# EAGLE design HX4002 CE021 + MAX40200 (EAGLE 9.6.2)
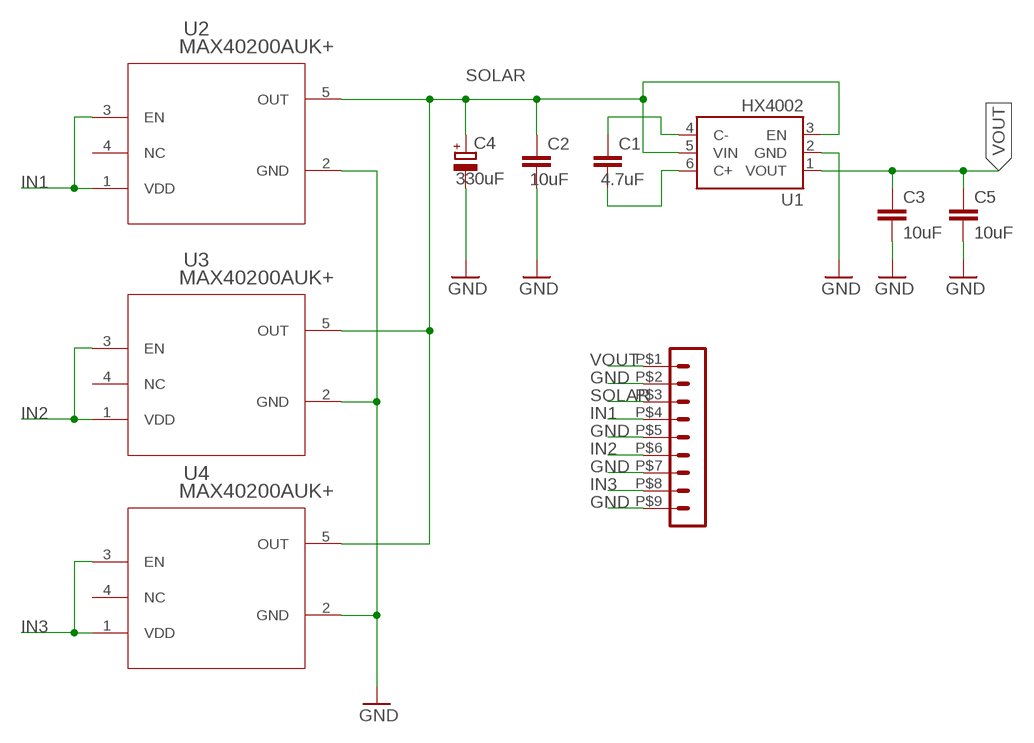
[diagram p0: schematic, sheet 1]

## Parts
C1  4.7uF  CAP-0805  [0805]
C2  10uF  CAP-0805  [0805]
C3  10uF  CAP-0805  [0805]
C4  330uF  CPOL-EUSMCC  [SMC_C]
C5  10uF  CAP-0805  [0805]
U1  HX4002  CE021SOT-23  [SOT23-6]
U2  MAX40200AUK+  [21-0057F_MXM]
U3  MAX40200AUK+  [21-0057F_MXM]
U4  MAX40200AUK+  [21-0057F_MXM]
X2  M_1R09_50MIL-V  [M_1R09_50MIL-V]

## Nets
GND: C2.2 C3.2 C4.- C5.2 U1.2(GND) U2.2(GND) U3.2(GND) U4.2(GND) X2.P$2 X2.P$5 X2.P$7 X2.P$9
IN1: U2.1(VDD) U2.3(EN) X2.P$4
IN2: U3.1(VDD) U3.3(EN) X2.P$6
IN3: U4.1(VDD) U4.3(EN) X2.P$8
N$1: C1.1 U1.4(C-)
N$3: C1.2 U1.6(C+)
SOLAR: C2.1 C4.+ U1.3(EN) U1.5(VIN) U2.5(OUT) U3.5(OUT) U4.5(OUT) X2.P$3
VOUT: C3.1 C5.1 U1.1(VOUT) X2.P$1
Unconnected: U2.4(NC) U3.4(NC) U4.4(NC)

## Library data of the parts
C1-C3 C5 = SparkFun-Capacitors:CAP
C4 = rcl:CPOL-EU: POLARIZED CAPACITOR, European symbol; SPICEPREFIX: C
U1 = CE021-KW:CE021: CE021 Hexin 3.3v Boost/Buck, SOT23-6 Datasheet <http://www.jiecx.com/files856985665897965/productpdf/2013-7-5/545010255.pdf>
U2-U4 = MAX40200AUK:MAX40200AUK+; BUILT_BY: EMA_UL_Team; COPYRIGHT: Copyright (C) 2018 Accelerated Designs. All rights reserved; MANUFACTURER_PART_NUMBER: MAX40200AUK+; SOURCELIBRARY: Maxim_2018-11-30; VENDOR: Maxim Integrated Products
X2 = con pinheader male:M_1R09: Pin header, male, 1 row

## Board
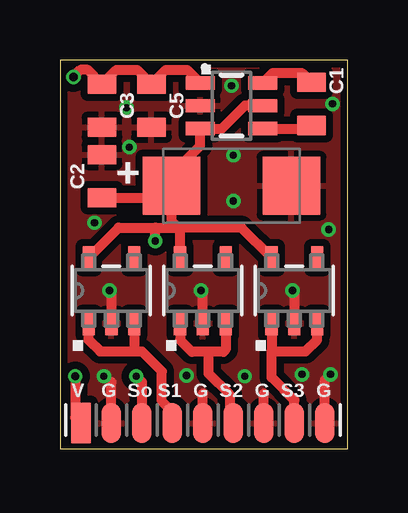
[diagram p1: board, top side]
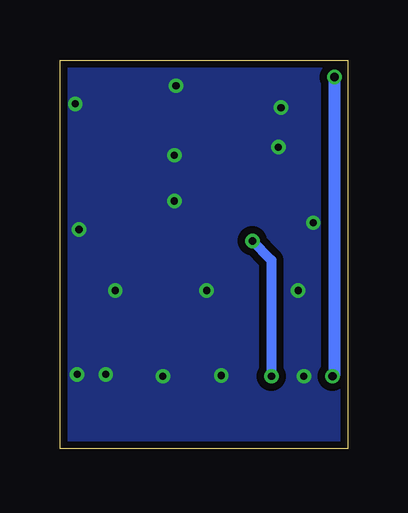
[diagram p2: board, bottom side, seen from below]

Size 11.99 x 16.19 mm. Coordinates in mm from the lower left corner, seen from the top.
Outline: 0,0 11.99,0 11.99,16.19 0,16.19 0,0
Copper layers (1*16): Top 0.035559375mm / dielectric 1.6mm / Bottom 0.035559375mm
Design rules "Arxterra-HLCpcb-2-layer-KW": minimum track width 6mil, minimum drill 0.3mm, track to track 6mil, track to pad 6mil, pad to pad 6mil, via to via 10mil, smd to smd 6mil, copper to edge 8mil, drill to drill 6mil, minimum pad ring 5mil, minimum via ring 3mil, stop-mask expansion 2.5mil, vias tented up to drill 25mil, thermal gap 10mil

### Footprints (pad centres in the part's own frame; a part is rotated, then mirrored left to right if it is on the bottom)
0805 = smd 0.8 x 1.2: 1 -0.9,0; 2 0.9,0
SMC_C = smd 2.4 x 2.4: + -2.5,0; - 2.5,0
SOT23-6 = smd 0.55 x 1.2: 1 0.95,1.3; 2 0,1.3; 3 -0.95,1.3; 4 -0.95,-1.3; 5 0,-1.3; 6 0.95,-1.3
21-0057F_MXM = smd 0.978 x 0.508: 1 -1.365,0.95; 2 -1.365,0; 3 -1.365,-0.95; 4 1.365,-0.95; 5 1.365,0.95
M_1R09_50MIL-V = smd 0.813 x 1.676: P$1 -5.08,-0.127; P$2 -3.81,-0.127; P$3 -2.54,-0.127; P$4 -1.27,-0.127; P$5 0,-0.127; P$6 1.27,-0.127; P$7 2.54,-0.127; P$8 3.81,-0.127; P$9 5.08,-0.127

### Placement (x,y rotation side)
C1  10.48,14.37 90 top
C2  1.75,11.35 90 top
C3  1.75,14.29 270 top
C4  7.14,10.95 0 top
C5  3.81,14.29 270 top
U1  7.14,14.29 90 top
U2  2.14,6.59 90 top
U3  5.95,6.59 90 top
U4  9.76,6.59 90 top
X2  5.95,1.19 0 top

### Tracks (layer width: path | path; a pad name or v marks a point on that pad's centre or on a via)
GND  (via drill 0.3 pad 0.6)
  Top 0.406: U3.2 5.95,6.51 | U2.2 2.14,6.51 v2.06,6.59 | U4.2 9.76,6.51 v9.68,6.59 | X2.P$2 2.14,2.78 | X2.P$5 5.95,2.3 | X2.P$7 8.49,2.3 | X2.P$9 11.03,2.86 v11.27,3.1
  other vias: 5.87,6.59 7.15,15.12 1.83,3.02 7.7,3.02 10.08,3.1 5.27,3.04 1.43,9.41 11.19,9.13 2.89,12.56 7.22,10.32 11.35,14.37 7.22,12.22 2.77,14.21
  pour Top (isolate 0.305): 0,0 0,16.19 11.99,16.19 11.99,0
  pour Bottom (isolate 0.305): 0,0 0,16.19 11.99,16.19 11.99,0
IN1
  Top 0.406: U2.3 3.09,4.05 3.1,4.05 | X2.P$4 4.68,1.54 4.25,1.98 4.25,3.21 3.41,4.05 3.1,4.05 | U2.1 1.19,4.52 1.67,4.05 3.1,4.05
IN2
  Top 0.406: U3.1 5,4.53 5,4.52 5.5,4.03 6.19,4.03 | U3.3 6.91,4.13 6.81,4.03 6.19,4.03 | X2.P$6 7.06,1.22 7.06,2.26 6.19,3.13 6.19,4.03
IN3
  Top 0.406: U4.1 8.81,4.05 | U4.3 10.72,4.52 10.24,4.05 8.81,4.05 | X2.P$8 9.76,2.02 8.81,2.97 8.81,4.05
N$1
  Top 0.406: U1.4 10.35,13.34 C1.1
N$3
  Top 0.406: U1.6 8.84,15.63 10.11,15.63 C1.2
SOLAR  (via drill 0.3 pad 0.6)
  Top 0.406: U1.5 7.7,14.29 6.75,13.34 U1.3 5.84,12.62 4.64,11.42 C4.+ | U3.5 5,9.21 | U2.5 2.45,9.21 3.97,9.21 | 3.97,9.21 4.92,9.21 | U4.5 7.56,9.21 5,9.21 | 5,9.21 4.92,9.21 | C2.1 4.14,10.45 C4.+ | C4.+ 4.64,9.49 4.92,9.21 | v3.97,8.65 3.97,9.21 | v3.17,3.02 3.41,2.78 X2.P$3
  Bottom 0.406: v3.17,3.02 3.17,7.86 v3.97,8.65
VOUT  (via drill 0.35 pad 0.6)
  Top 0.406: v0.56,15.48 0.85,15.78 1.16,15.78 C3.1 2.35,15.79 3.21,15.79 C5.1 4.41,15.79 5.29,15.79 U1.1 | v0.64,3.02 0.64,1.3 X2.P$1
  Bottom 0.406: 0.56,3.1 v0.64,3.02
  Bottom 0.508: v0.56,15.48 0.56,3.1

### Text on the board
tPlace: . | + | . | . | .
tNames: V G So S1 G S2 G S3 G
_tNames: C1 | C3 | C5 | C2